# EAGLE schematic VistelV3 (EAGLE 6.4)

## Sheet 1 of 5
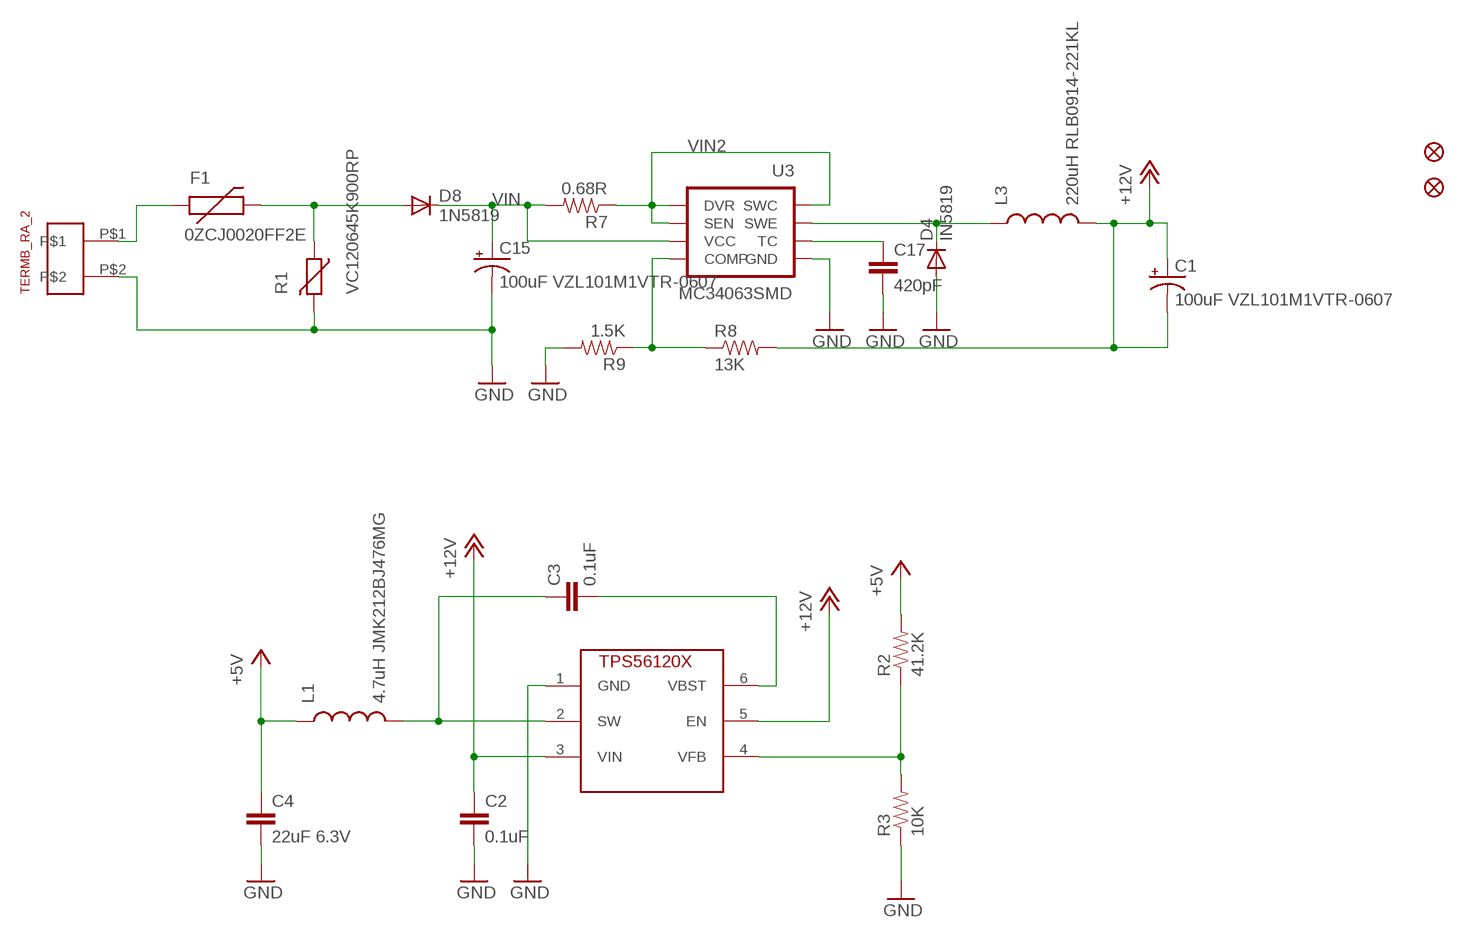
[diagram p0: schematic, sheet 1]

### Parts
C1  100uF VZL101M1VTR-0607  CAP_POLD  [PANASONIC_D]
C2  0.1uF  CAP0805  [0805]
C3  0.1uF  CAP0805  [0805]
C4  22uF 6.3V  CAP0805  [0805]
C15  100uF VZL101M1VTR-0607  CAP_POLD  [PANASONIC_D]
C17  420pF  CAP0805  [0805]
D4  IN5819  DIODESMA  [SMA-DIODE]
D8  1N5819  DIODESMB  [SMB-DIODE]
F1  0ZCJ0020FF2E  PTCSMD  [PTC-1206]
FID1  FIDUCIAL1.5X3  [FIDUCIAL-1.5X3]
FID2  FIDUCIAL1.5X3  [FIDUCIAL-1.5X3]
L1  4.7uH JMK212BJ476MG  INDUCTOR0805  [0805]
L3  220uH RLB0914-221KL  INDUCTORPWR  [CDRH125]
R1  VC120645K900RP  VARISTORCN1206  [CT/CN1206]
R2  41.2K  RESISTOR0805-RES  [0805]
R3  10K  RESISTOR0805-RES  [0805]
R7  0.68R  RESISTOR0805-RES  [0805]
R8  13K  RESISTOR0805-RES  [0805]
R9  1.5K  RESISTOR0805-RES  [0805]
U3  MC34063SMD  [SO08]
U$2  1X02_TERMB_RA  [1X02_TERMB_RA]
U$18  TPS56120X  [TSOT23-6_DDC]

### Nets
+5V: C4.1 L1.1 R2.2
+12V: C1.+ C1.- C2.1 L3.2 R8.2 U$18.3(VIN) U$18.5(EN) ; also sheet 3
GND: C2.2 C4.2 C15.- C17.2 D4.A R1.2 R3.1 R9.2 U3.4(GND) U$2.P$2 U$18.1(GND) ; also sheet 2,3,4,5
N$4: F1.1 U$2.P$1
N$5: D8.A F1.2 R1.1
N$6: C3.1 L1.2 U$18.2(SW)
N$19: C3.2 U$18.6(VBST)
N$20: R2.1 R3.2 U$18.4(VFB)
N$22: C17.1 U3.3(TC)
N$24: D4.C L3.1 U3.2(SWE)
N$25: R8.1 R9.1 U3.5(COMP)
VIN: C15.+ D8.C R7.2 U3.6(VCC)
VIN2: R7.1 U3.1(SWC) U3.7(SEN) U3.8(DVR)

## Sheet 2 of 5
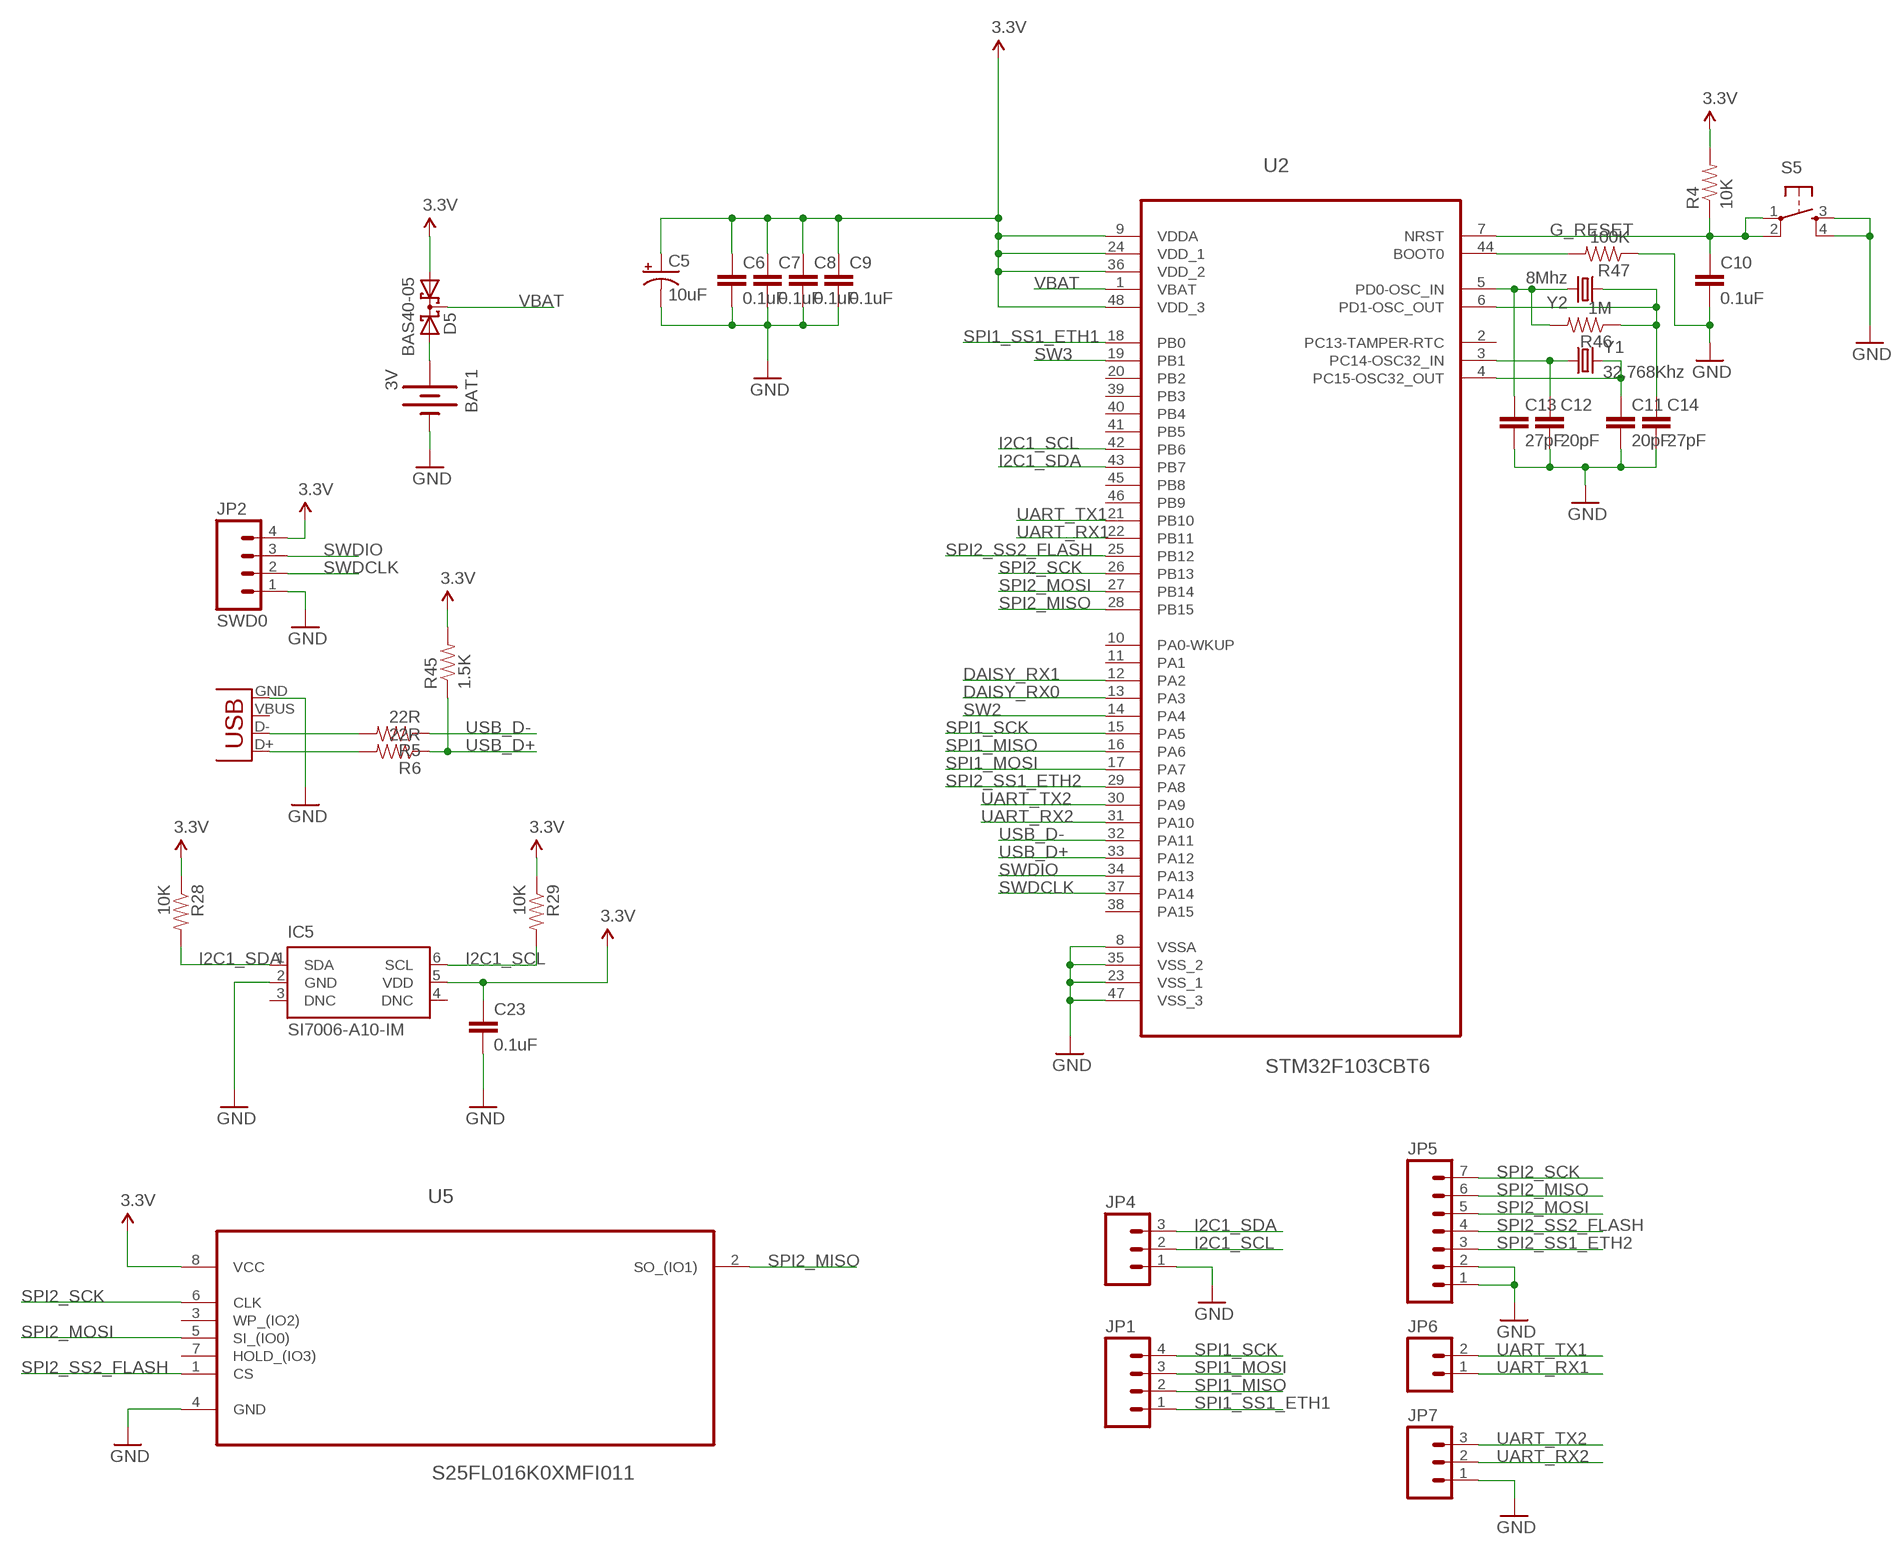
[diagram p1: schematic, sheet 2]

### Parts
BAT1  3V  BATTERY20PTH  [BATTCOM_20MM_PTH]
C5  10uF  10UF-TANT  [EIA3216]
C6  0.1uF  CAP0805  [0805]
C7  0.1uF  CAP0805  [0805]
C8  0.1uF  CAP0805  [0805]
C9  0.1uF  CAP0805  [0805]
C10  0.1uF  CAP0805  [0805]
C11  20pF  CAP0805  [0805]
C12  20pF  CAP0805  [0805]
C13  27pF  CAP0805  [0805]
C14  27pF  CAP0805  [0805]
C23  0.1uF  CAP0805  [0805]
D5  BAS40-05  [SOT23]
IC5  SI7006-A10-IM  [DFN6-3X3]
JP1  M04PTH  [1X04]
JP2  SWD0  M04PTH  [1X04]
JP3  USB-B  USBPTH  [USB-B-PTH]
JP4  M03PTH  [1X03]
JP5  M07  [1X07]
JP6  M02PTH  [1X02]
JP7  M03PTH  [1X03]
R4  10K  RESISTOR0805-RES  [0805]
R5  22R  RESISTOR0805-RES  [0805]
R6  22R  RESISTOR0805-RES  [0805]
R28  10K  RESISTOR0805-RES  [0805]
R29  10K  RESISTOR0805-RES  [0805]
R45  1.5K  RESISTOR0805-RES  [0805]
R46  1M  RESISTOR0805-RES  [0805]
R47  100K  RESISTOR0805-RES  [0805]
S5  TAC_SWITCHPTH  [TACTILE-PTH]
U2  STM32F103CBT6  [QFP50P900X900X160-48N]
U5  S25FL016K0XMFI011  [SOIC127P800X215-8N]
Y1  32.768Khz  MC-306  [MC-306]
Y2  8Mhz  CRYSTALHC49US  [HC49US]

### Nets
3.3V: C5.A(+) C6.1 C7.1 C8.1 C9.1 C23.1 D5.1(A1) IC5.5(VDD) JP2.4 R4.2 R28.1 R29.1 R45.2 U2.9(VDDA) U2.24(VDD_1) U2.36(VDD_2) U2.48(VDD_3) U5.8(VCC) ; also sheet 3,4
BOOT0: R47.2 U2.44(BOOT0)
DAISY_RX0: U2.13(PA3) ; also sheet 3
DAISY_RX1: U2.12(PA2) ; also sheet 3
G_RESET: C10.1 R4.1 S5.1 S5.2 U2.7(NRST) ; also sheet 3
GND: BAT1.2(-) C5.C(-) C6.2 C7.2 C8.2 C9.2 C10.2 C11.2 C12.2 C13.2 C14.2 C23.2 IC5.2(GND) JP2.1 JP3.GND JP4.1 JP5.1 JP5.2 JP7.1 R47.1 S5.3 S5.4 U2.8(VSSA) U2.23(VSS_1) U2.35(VSS_2) U2.47(VSS_3) U5.4(GND) ; also sheet 1,3,4,5
I2C1_SCL: IC5.6(SCL) JP4.2 R29.2 U2.42(PB6)
I2C1_SDA: IC5.1(SDA) JP4.3 R28.2 U2.43(PB7)
N$3: BAT1.1(+) D5.2(A2)
N$7: C14.1 R46.1 U2.6(PD1-OSC_OUT) Y2.1
N$10: JP3.D- R5.2
N$11: JP3.D+ R6.2
N$14: C12.1 U2.3(PC14-OSC32_IN) Y1.1
N$15: C11.1 U2.4(PC15-OSC32_OUT) Y1.4
N$16: C13.1 R46.2 U2.5(PD0-OSC_IN) Y2.2
SPI1_MISO: JP1.2 U2.16(PA6) ; also sheet 4
SPI1_MOSI: JP1.3 U2.17(PA7) ; also sheet 4
SPI1_SCK: JP1.4 U2.15(PA5) ; also sheet 4
SPI1_SS1_ETH1: JP1.1 U2.18(PB0) ; also sheet 4
SPI2_MISO: JP5.6 U2.28(PB15) U5.2(SO_(IO1)) ; also sheet 4
SPI2_MOSI: JP5.5 U2.27(PB14) U5.5(SI_(IO0)) ; also sheet 4
SPI2_SCK: JP5.7 U2.26(PB13) U5.6(CLK) ; also sheet 4
SPI2_SS1_ETH2: JP5.3 U2.29(PA8) ; also sheet 4
SPI2_SS2_FLASH: JP5.4 U2.25(PB12) U5.1(CS)
SW2: U2.14(PA4) ; also sheet 3
SW3: U2.19(PB1) ; also sheet 3
SWDCLK: JP2.2 U2.37(PA14)
SWDIO: JP2.3 U2.34(PA13)
UART_RX1: JP6.1 U2.22(PB11)
UART_RX2: JP7.2 U2.31(PA10) ; also sheet 5
UART_TX1: JP6.2 U2.21(PB10)
UART_TX2: JP7.3 U2.30(PA9) ; also sheet 5
USB_D+: R6.1 R45.1 U2.33(PA12)
USB_D-: R5.1 U2.32(PA11)
VBAT: D5.3(C) U2.1(VBAT)
Unconnected: IC5.3(DNC) IC5.4(DNC) JP3.VBUS U2.2(PC13-TAMPER-RTC) U2.10(PA0-WKUP) U2.11(PA1) U2.20(PB2) U2.38(PA15) U2.39(PB3) U2.40(PB4) U2.41(PB5) U2.45(PB8) U2.46(PB9) U5.3(WP_(IO2)) U5.7(HOLD_(IO3))

## Sheet 3 of 5
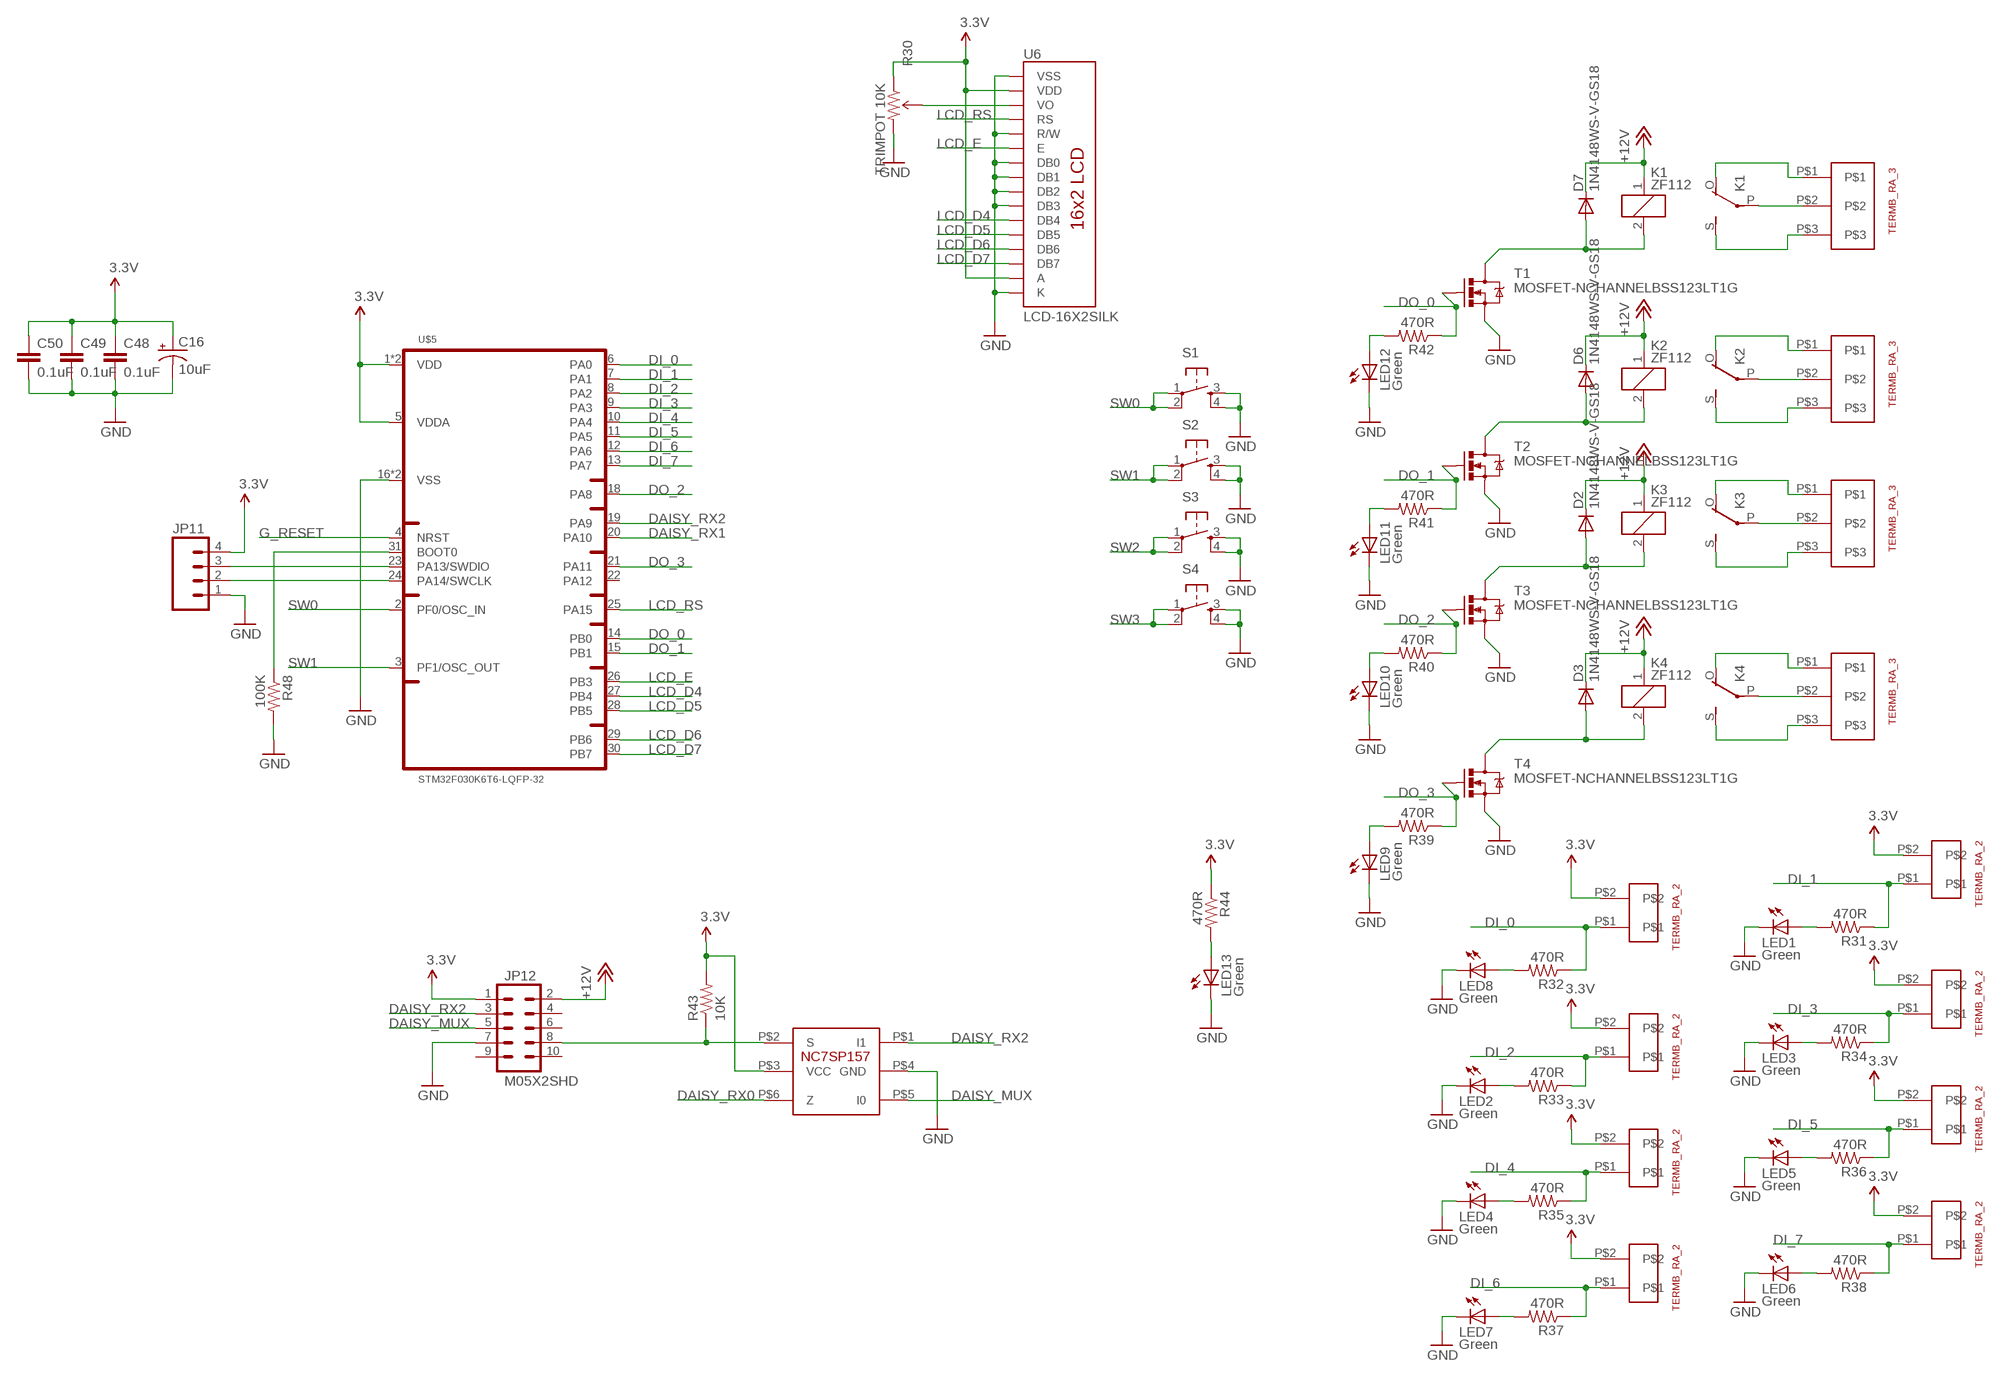
[diagram p2: schematic, sheet 3]

### Parts
C16  10uF  10UF-TANT  [EIA3216]
C48  0.1uF  CAP0805  [0805]
C49  0.1uF  CAP0805  [0805]
C50  0.1uF  CAP0805  [0805]
D2  1N4148WS-V-GS18  DIODESMA-ALT  [SMA-DIODE_ALT]
D3  1N4148WS-V-GS18  DIODESMA-ALT  [SMA-DIODE_ALT]
D6  1N4148WS-V-GS18  DIODESMA-ALT  [SMA-DIODE_ALT]
D7  1N4148WS-V-GS18  DIODESMA-ALT  [SMA-DIODE_ALT]
JP11  M04PTH  [1X04]
JP12  M05X2SHD  [2X5-SHROUDED]
K1  ZF112  [ZF112]
K2  ZF112  [ZF112]
K3  ZF112  [ZF112]
K4  ZF112  [ZF112]
LED1  Green  LED1206  [LED-1206]
LED2  Green  LED1206  [LED-1206]
LED3  Green  LED1206  [LED-1206]
LED4  Green  LED1206  [LED-1206]
LED5  Green  LED1206  [LED-1206]
LED6  Green  LED1206  [LED-1206]
LED7  Green  LED1206  [LED-1206]
LED8  Green  LED1206  [LED-1206]
LED9  Green  LED1206  [LED-1206]
LED10  Green  LED1206  [LED-1206]
LED11  Green  LED1206  [LED-1206]
LED12  Green  LED1206  [LED-1206]
LED13  Green  LED1206  [LED-1206]
R30  TRIMPOT 10K  TRIMPOTPTH  [TRIM_POT_PTH]
R31  470R  RESISTOR0805-RES  [0805]
R32  470R  RESISTOR0805-RES  [0805]
R33  470R  RESISTOR0805-RES  [0805]
R34  470R  RESISTOR0805-RES  [0805]
R35  470R  RESISTOR0805-RES  [0805]
R36  470R  RESISTOR0805-RES  [0805]
R37  470R  RESISTOR0805-RES  [0805]
R38  470R  RESISTOR0805-RES  [0805]
R39  470R  RESISTOR0805-RES  [0805]
R40  470R  RESISTOR0805-RES  [0805]
R41  470R  RESISTOR0805-RES  [0805]
R42  470R  RESISTOR0805-RES  [0805]
R43  10K  RESISTOR0805-RES  [0805]
R44  470R  RESISTOR0805-RES  [0805]
R48  100K  RESISTOR0805-RES  [0805]
S1  TAC_SWITCHPTH  [TACTILE-PTH]
S2  TAC_SWITCHPTH  [TACTILE-PTH]
S3  TAC_SWITCHPTH  [TACTILE-PTH]
S4  TAC_SWITCHPTH  [TACTILE-PTH]
T1  MOSFET-NCHANNELBSS123LT1G  [SOT23]
T2  MOSFET-NCHANNELBSS123LT1G  [SOT23]
T3  MOSFET-NCHANNELBSS123LT1G  [SOT23]
T4  MOSFET-NCHANNELBSS123LT1G  [SOT23]
U6  LCD-16X2SILK  [LCD-16X2]
U$4  NC7SP157  [SC70-6]
U$5  STM32F030K6T6-LQFP-32  [LQFP-32]
U$6  1X02_TERMB_RA  [1X02_TERMB_RA]
U$7  1X02_TERMB_RA  [1X02_TERMB_RA]
U$8  1X02_TERMB_RA  [1X02_TERMB_RA]
U$9  1X02_TERMB_RA  [1X02_TERMB_RA]
U$10  1X02_TERMB_RA  [1X02_TERMB_RA]
U$11  1X02_TERMB_RA  [1X02_TERMB_RA]
U$12  1X02_TERMB_RA  [1X02_TERMB_RA]
U$13  1X02_TERMB_RA  [1X02_TERMB_RA]
U$14  1X03_TERMB_RA  [1X03_TERMB_RA]
U$15  1X03_TERMB_RA  [1X03_TERMB_RA]
U$16  1X03_TERMB_RA  [1X03_TERMB_RA]
U$17  1X03_TERMB_RA  [1X03_TERMB_RA]

### Nets
3.3V: C16.A(+) C48.1 C49.1 C50.1 JP11.4 JP12.1 R30.1(CCW) R43.2 R44.1 U6.2(VDD) U6.15(A) U$4.P$3(VCC) U$5.1(VDD) U$5.5(VDDA) U$5.17(VDD) U$6.P$2 U$7.P$2 U$8.P$2 U$9.P$2 U$10.P$2 U$11.P$2 U$12.P$2 U$13.P$2 ; also sheet 2,4
+12V: D2.C D3.C D6.C D7.C JP12.2 K1.1 K2.1 K3.1 K4.1 ; also sheet 1
DAISY_MUX: JP12.5 U$4.P$5(I0)
DAISY_RX0: U$4.P$6(Z) ; also sheet 2
DAISY_RX1: U$5.20(PA10) ; also sheet 2
DAISY_RX2: JP12.3 U$4.P$1(I1) U$5.19(PA9)
DI_0: R32.1 U$5.6(PA0) U$6.P$1
DI_1: R31.1 U$5.7(PA1) U$7.P$1
DI_2: R33.1 U$5.8(PA2) U$13.P$1
DI_3: R34.1 U$5.9(PA3) U$8.P$1
DI_4: R35.1 U$5.10(PA4) U$12.P$1
DI_5: R36.1 U$5.11(PA5) U$9.P$1
DI_6: R37.1 U$5.12(PA6) U$11.P$1
DI_7: R38.1 U$5.13(PA7) U$10.P$1
DO_0: R42.1 T1.1(G) U$5.14(PB0)
DO_1: R41.1 T2.1(G) U$5.15(PB1)
DO_2: R40.1 T3.1(G) U$5.18(PA8)
DO_3: R39.1 T4.1(G) U$5.21(PA11)
G_RESET: U$5.4(NRST) ; also sheet 2
GND: C16.C(-) C48.2 C49.2 C50.2 JP11.1 JP12.7 LED1.C LED2.C LED3.C LED4.C LED5.C LED6.C LED7.C LED8.C LED9.C LED10.C LED11.C LED12.C LED13.C R30.3(CW) R48.2 S1.3 S1.4 S2.3 S2.4 S3.3 S3.4 S4.3 S4.4 T1.2(S) T2.2(S) T3.2(S) T4.2(S) U6.1(VSS) U6.5(R/W) U6.7(DB0) U6.8(DB1) U6.9(DB2) U6.10(DB3) U6.16(K) U$4.P$4(GND) U$5.16(VSS) U$5.32(VSS) ; also sheet 1,2,4,5
LCD_D4: U6.11(DB4) U$5.27(PB4)
LCD_D5: U6.12(DB5) U$5.28(PB5)
LCD_D6: U6.13(DB6) U$5.29(PB6)
LCD_D7: U6.14(DB7) U$5.30(PB7)
LCD_E: U6.6(E) U$5.26(PB3)
LCD_RS: U6.4(RS) U$5.25(PA15)
N$1: K1.P(2:P) U$14.P$2
N$8: LED13.A R44.2
N$9: LED7.A R37.2
N$12: R30.2(WIPER) U6.3(VO)
N$13: K4.O(2:O) U$17.P$1
N$17: R48.1 U$5.31(BOOT0)
N$21: K4.S(2:S) U$17.P$3
N$53: K3.S(2:S) U$16.P$3
N$54: K2.P(2:P) U$15.P$2
N$55: K3.O(2:O) U$16.P$1
N$56: K2.O(2:O) U$15.P$1
N$57: K2.S(2:S) U$15.P$3
N$58: K3.P(2:P) U$16.P$2
N$59: K1.O(2:O) U$14.P$1
N$60: K4.P(2:P) U$17.P$2
N$61: K1.S(2:S) U$14.P$3
N$62: D7.A K1.2 T1.3(D)
N$63: D6.A K2.2 T2.3(D)
N$64: D2.A K3.2 T3.3(D)
N$65: D3.A K4.2 T4.3(D)
N$66: LED12.A R42.2
N$67: LED11.A R41.2
N$69: JP11.3 U$5.23(PA13/SWDIO)
N$70: LED10.A R40.2
N$71: JP11.2 U$5.24(PA14/SWCLK)
N$72: LED9.A R39.2
N$73: LED1.A R31.2
N$74: LED8.A R32.2
N$75: LED2.A R33.2
N$77: JP12.8 R43.1 U$4.P$2(S)
N$78: LED3.A R34.2
N$80: LED5.A R36.2
N$82: LED4.A R35.2
N$87: LED6.A R38.2
SW0: S1.1 S1.2 U$5.2(PF0/OSC_IN)
SW1: S2.1 S2.2 U$5.3(PF1/OSC_OUT)
SW2: S3.1 S3.2 ; also sheet 2
SW3: S4.1 S4.2 ; also sheet 2
Unconnected: JP12.4 JP12.6 JP12.9 JP12.10 U$5.22(PA12)

## Sheet 4 of 5
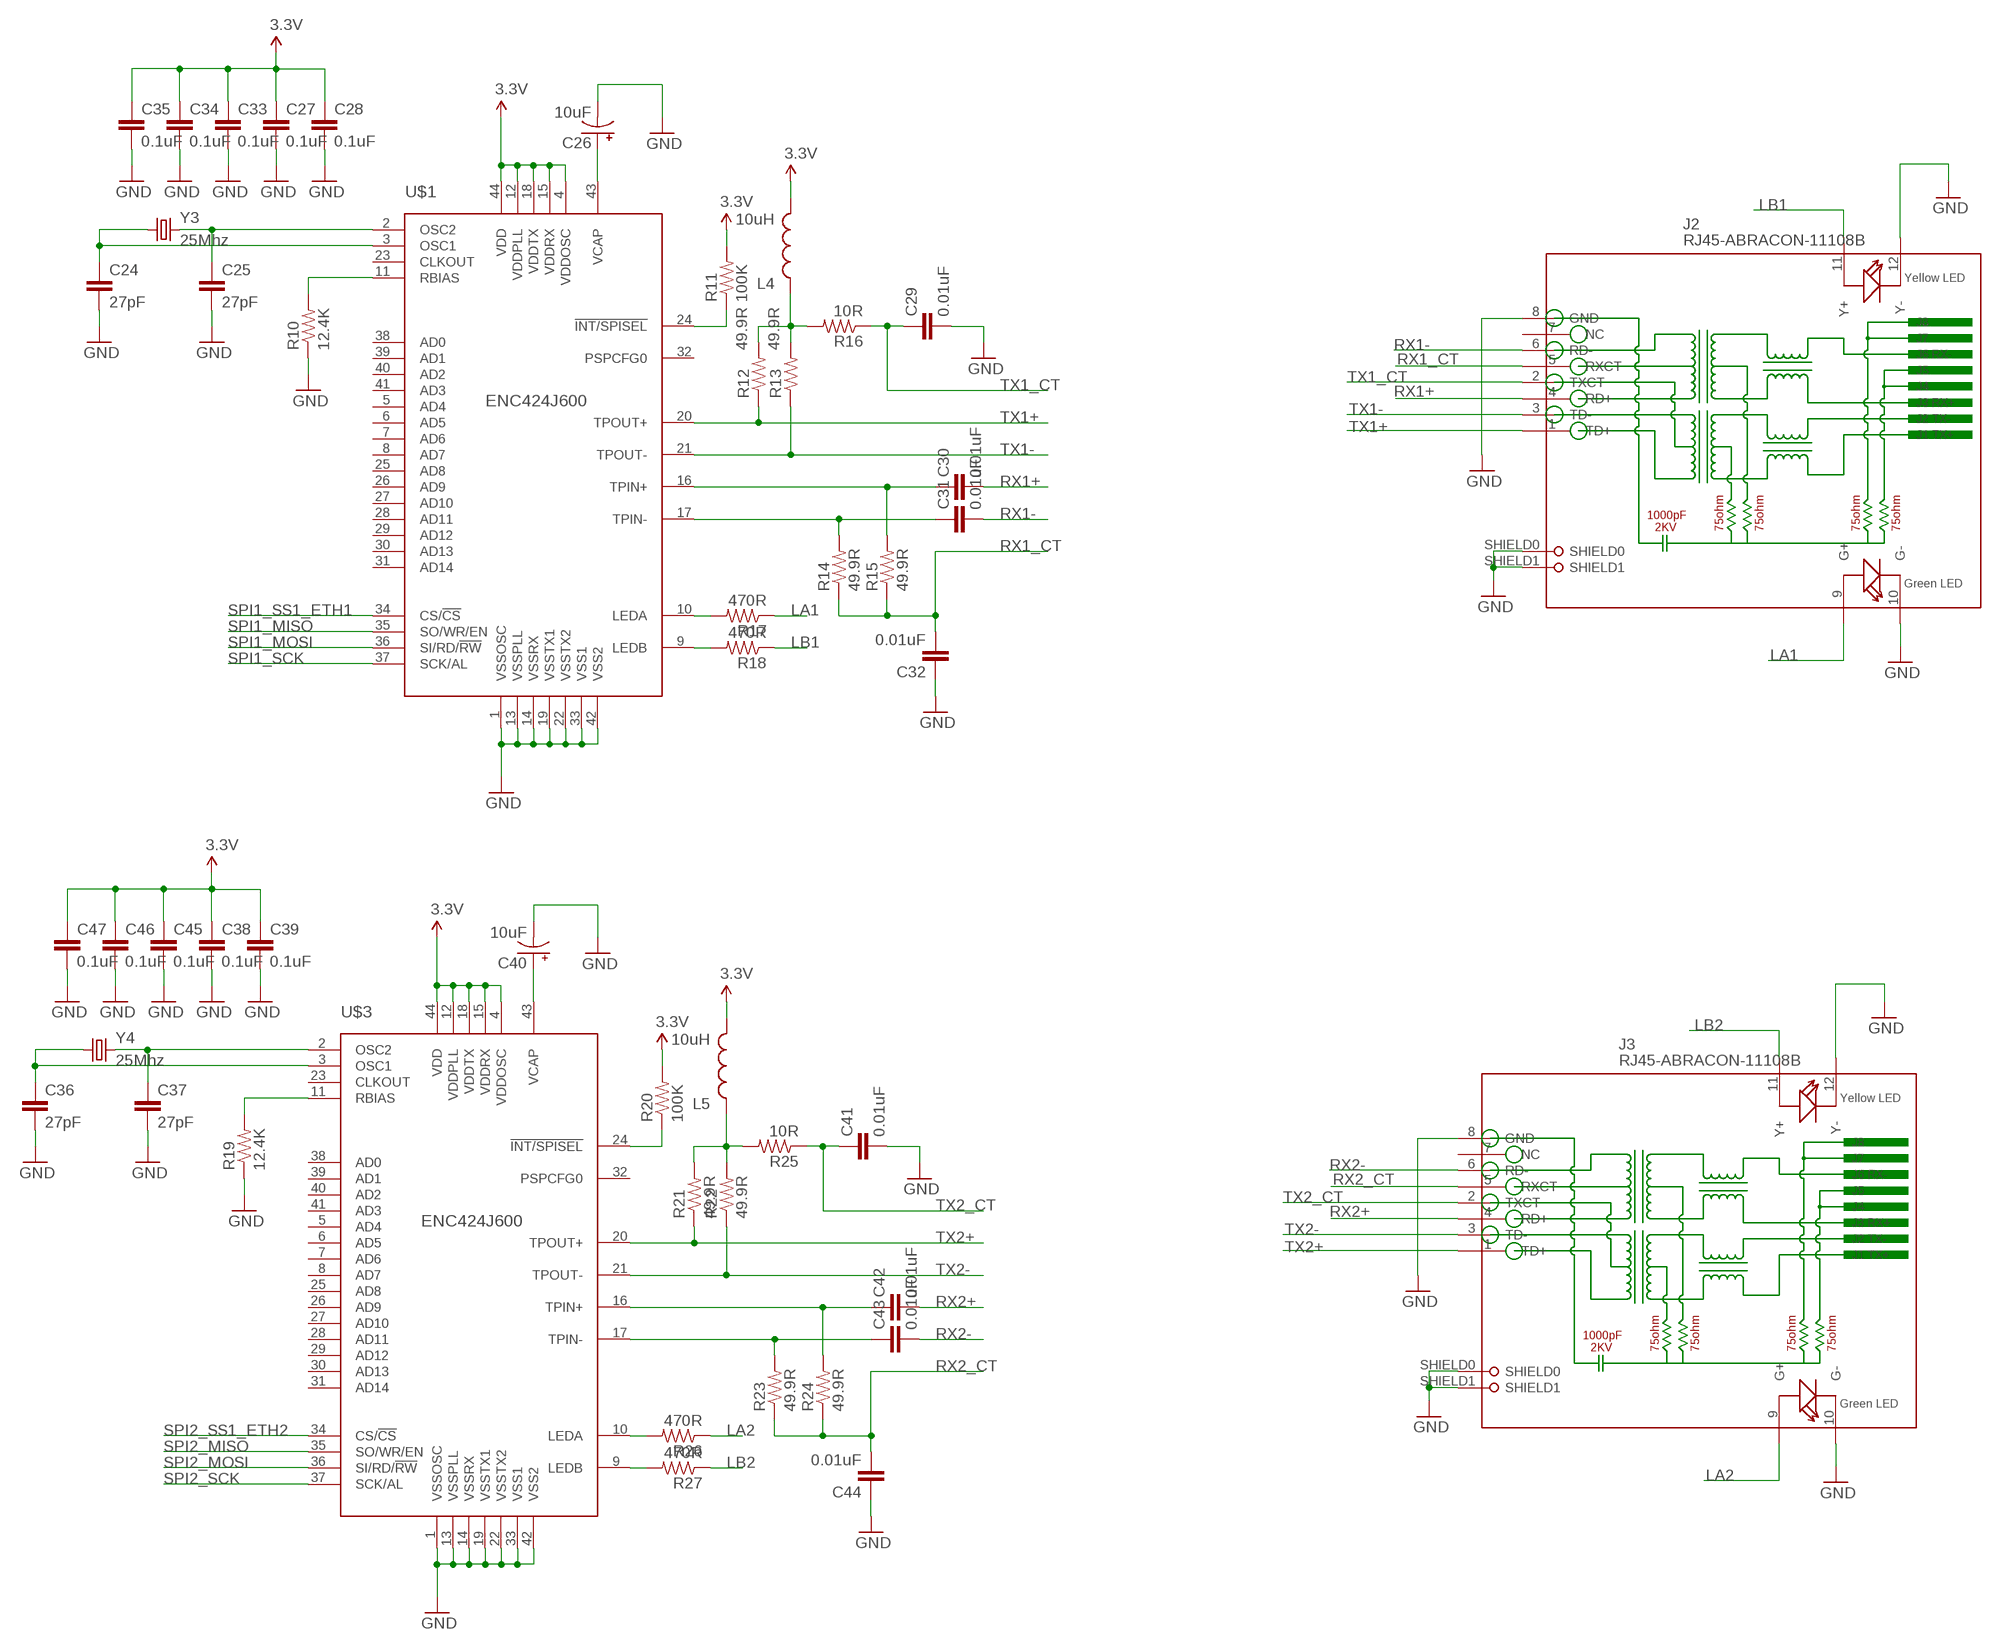
[diagram p3: schematic, sheet 4]

### Parts
C24  27pF  CAP0805  [0805]
C25  27pF  CAP0805  [0805]
C26  10uF  CAP_POL3528-KIT  [EIA3528-KIT]
C27  0.1uF  CAP0805  [0805]
C28  0.1uF  CAP0805  [0805]
C29  0.01uF  CAP0805  [0805]
C30  0.01uF  CAP0805  [0805]
C31  0.01uF  CAP0805  [0805]
C32  0.01uF  CAP0805  [0805]
C33  0.1uF  CAP0805  [0805]
C34  0.1uF  CAP0805  [0805]
C35  0.1uF  CAP0805  [0805]
C36  27pF  CAP0805  [0805]
C37  27pF  CAP0805  [0805]
C38  0.1uF  CAP0805  [0805]
C39  0.1uF  CAP0805  [0805]
C40  10uF  CAP_POL3528-KIT  [EIA3528-KIT]
C41  0.01uF  CAP0805  [0805]
C42  0.01uF  CAP0805  [0805]
C43  0.01uF  CAP0805  [0805]
C44  0.01uF  CAP0805  [0805]
C45  0.1uF  CAP0805  [0805]
C46  0.1uF  CAP0805  [0805]
C47  0.1uF  CAP0805  [0805]
J2  RJ45-ABRACON-11108B  [RJ45-ABRACON-111008B]
J3  RJ45-ABRACON-11108B  [RJ45-ABRACON-111008B]
L4  10uH  INDUCTOR0805  [0805]
L5  10uH  INDUCTOR0805  [0805]
R10  12.4K  RESISTOR0805-RES  [0805]
R11  100K  RESISTOR0805-RES  [0805]
R12  49.9R  RESISTOR0805-RES  [0805]
R13  49.9R  RESISTOR0805-RES  [0805]
R14  49.9R  RESISTOR0805-RES  [0805]
R15  49.9R  RESISTOR0805-RES  [0805]
R16  10R  RESISTOR0805-RES  [0805]
R17  470R  RESISTOR0805-RES  [0805]
R18  470R  RESISTOR0805-RES  [0805]
R19  12.4K  RESISTOR0805-RES  [0805]
R20  100K  RESISTOR0805-RES  [0805]
R21  49.9R  RESISTOR0805-RES  [0805]
R22  49.9R  RESISTOR0805-RES  [0805]
R23  49.9R  RESISTOR0805-RES  [0805]
R24  49.9R  RESISTOR0805-RES  [0805]
R25  10R  RESISTOR0805-RES  [0805]
R26  470R  RESISTOR0805-RES  [0805]
R27  470R  RESISTOR0805-RES  [0805]
U$1  ENC424J600  [TQFP-44]
U$3  ENC424J600  [TQFP-44]
Y3  25Mhz  CRYSTAL10.5X4.8  [CRYSTAL-SMD-10.5X4.8-2PIN]
Y4  25Mhz  CRYSTAL10.5X4.8  [CRYSTAL-SMD-10.5X4.8-2PIN]

### Nets
3.3V: C27.1 C28.1 C33.1 C34.1 C35.1 C38.1 C39.1 C45.1 C46.1 C47.1 L4.2 L5.2 R11.2 R20.2 U$1.4(VDDOSC) U$1.12(VDDPLL) U$1.15(VDDRX) U$1.18(VDDTX) U$1.44(VDD) U$3.4(VDDOSC) U$3.12(VDDPLL) U$3.15(VDDRX) U$3.18(VDDTX) U$3.44(VDD) ; also sheet 2,3
GND: C24.2 C25.2 C26.C(-) C27.2 C28.2 C29.2 C32.1 C33.2 C34.2 C35.2 C36.2 C37.2 C38.2 C39.2 C40.C(-) C41.2 C44.1 C45.2 C46.2 C47.2 J2.8(GND) J2.10(G-) J2.12(Y-) J2.SHIELD0 J2.SHIELD1 J3.8(GND) J3.10(G-) J3.12(Y-) J3.SHIELD0 J3.SHIELD1 R10.1 R19.1 U$1.1(VSSOSC) U$1.13(VSSPLL) U$1.14(VSSRX) U$1.19(VSSTX1) U$1.22(VSSTX2) U$1.33(VSS1) U$1.42(VSS2) U$3.1(VSSOSC) U$3.13(VSSPLL) U$3.14(VSSRX) U$3.19(VSSTX1) U$3.22(VSSTX2) U$3.33(VSS1) U$3.42(VSS2) ; also sheet 1,2,3,5
LA1: J2.9(G+) R17.1
LA2: J3.9(G+) R26.1
LB1: J2.11(Y+) R18.1
LB2: J3.11(Y+) R27.1
N$33: C24.1 U$1.3(OSC1) Y3.P$1
N$34: C40.A(+) U$3.43(VCAP)
N$35: C37.1 U$3.2(OSC2) Y4.P$2
N$36: C30.1 R15.2 U$1.16(TPIN+)
N$37: C26.A(+) U$1.43(VCAP)
N$38: C31.1 R14.2 U$1.17(TPIN-)
N$39: R19.2 U$3.11(RBIAS)
N$40: C25.1 U$1.2(OSC2) Y3.P$2
N$41: R10.2 U$1.11(RBIAS)
N$42: R11.1 U$1.24(!INT/SPISEL)
N$43: R17.2 U$1.10(LEDA)
N$44: R18.2 U$1.9(LEDB)
N$45: L4.1 R12.2 R13.2 R16.2
N$46: R20.1 U$3.24(!INT/SPISEL)
N$47: C36.1 U$3.3(OSC1) Y4.P$1
N$48: C42.1 R24.2 U$3.16(TPIN+)
N$49: C43.1 R23.2 U$3.17(TPIN-)
N$50: L5.1 R21.2 R22.2 R25.2
N$51: R26.2 U$3.10(LEDA)
N$52: R27.2 U$3.9(LEDB)
RX1+: C30.2 J2.4(RD+)
RX1-: C31.2 J2.6(RD-)
RX1_CT: C32.2 J2.5(RXCT) R14.1 R15.1
RX2+: C42.2 J3.4(RD+)
RX2-: C43.2 J3.6(RD-)
RX2_CT: C44.2 J3.5(RXCT) R23.1 R24.1
SPI1_MISO: U$1.35(SO/WR/EN) ; also sheet 2
SPI1_MOSI: U$1.36(SI/RD/!RW) ; also sheet 2
SPI1_SCK: U$1.37(SCK/AL) ; also sheet 2
SPI1_SS1_ETH1: U$1.34(CS/!CS) ; also sheet 2
SPI2_MISO: U$3.35(SO/WR/EN) ; also sheet 2
SPI2_MOSI: U$3.36(SI/RD/!RW) ; also sheet 2
SPI2_SCK: U$3.37(SCK/AL) ; also sheet 2
SPI2_SS1_ETH2: U$3.34(CS/!CS) ; also sheet 2
TX1+: J2.1(TD+) R12.1 U$1.20(TPOUT+)
TX1-: J2.3(TD-) R13.1 U$1.21(TPOUT-)
TX1_CT: C29.1 J2.2(TXCT) R16.1
TX2+: J3.1(TD+) R21.1 U$3.20(TPOUT+)
TX2-: J3.3(TD-) R22.1 U$3.21(TPOUT-)
TX2_CT: C41.1 J3.2(TXCT) R25.1
Unconnected: J2.7(NC) J3.7(NC) U$1.5(AD4) U$1.6(AD5) U$1.7(AD6) U$1.8(AD7) U$1.23(CLKOUT) U$1.25(AD8) U$1.26(AD9) U$1.27(AD10) U$1.28(AD11) U$1.29(AD12) U$1.30(AD13) U$1.31(AD14) U$1.32(PSPCFG0) U$1.38(AD0) U$1.39(AD1) U$1.40(AD2) U$1.41(AD3) U$3.5(AD4) U$3.6(AD5) U$3.7(AD6) U$3.8(AD7) U$3.23(CLKOUT) U$3.25(AD8) U$3.26(AD9) U$3.27(AD10) U$3.28(AD11) U$3.29(AD12) U$3.30(AD13) U$3.31(AD14) U$3.32(PSPCFG0) U$3.38(AD0) U$3.39(AD1) U$3.40(AD2) U$3.41(AD3)

## Sheet 5 of 5
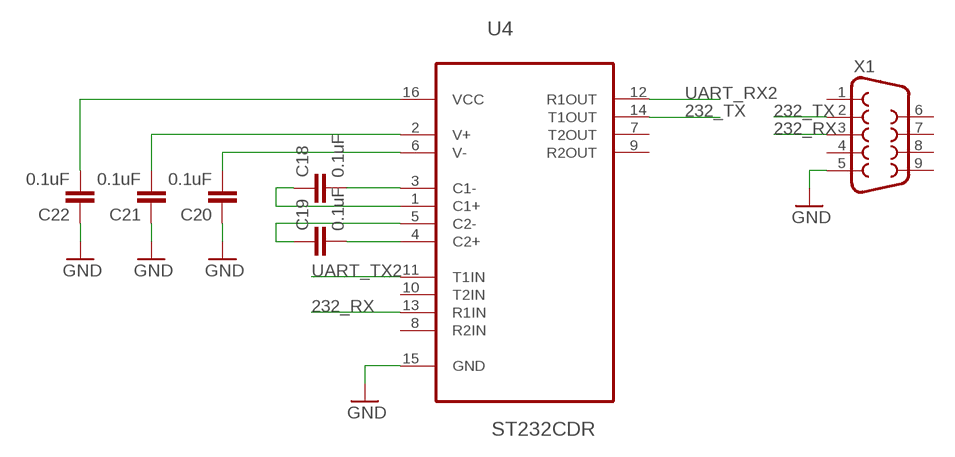
[diagram p4: schematic, sheet 5]

### Parts
C18  0.1uF  CAP0805  [0805]
C19  0.1uF  CAP0805  [0805]
C20  0.1uF  CAP0805  [0805]
C21  0.1uF  CAP0805  [0805]
C22  0.1uF  CAP0805  [0805]
U4  ST232CDR  [SOIC127P600X175-16N]
X1  DB9FEMALE  [DB9]

### Nets
232_RX: U4.13(R1IN) X1.3
232_TX: U4.14(T1OUT) X1.2
GND: C20.1 C21.1 C22.1 U4.15(GND) X1.5 ; also sheet 1,2,3,4
N$2: C22.2 U4.16(VCC)
N$26: C21.2 U4.2(V+)
N$27: C20.2 U4.6(V-)
N$28: C18.2 U4.3(C1-)
N$29: C18.1 U4.1(C1+)
N$30: C19.1 U4.5(C2-)
N$31: C19.2 U4.4(C2+)
UART_RX2: U4.12(R1OUT) ; also sheet 2
UART_TX2: U4.11(T1IN) ; also sheet 2
Unconnected: U4.7(T2OUT) U4.8(R2IN) U4.9(R2OUT) U4.10(T2IN) X1.1 X1.4 X1.6 X1.7 X1.8 X1.9

## Library data of the parts
BAT1 = SparkFun-Electromechanical:BATTERY: Battery Holders Various common sizes : AA, AAA, 20mm coin cell and 12mm coin cell. 20MM_4LEGS, BATT-10373
C1 C15 C26 C40 = SparkFun-Capacitors:CAP_POL: Capacitor Polarized These are standard SMD and PTH capacitors. Normally 10uF, 47uF, and 100uF in electrolytic and tantalum varieties. Always verify the external diameter of the through hole cap, it varies with capacity, voltage, and manufacturer. The EIA devices should be standard.
C2-C4 C17-C22 = SparkFun-Passives:CAP: Capacitor Standard 0603 ceramic capacitor, and 0.1" leaded capacitor.
C5 C16 = SparkFun-Capacitors:10UF-TANT: 10uF Tantalum SMT CAP-00811- 16V 10% (EIA-3216); PROD_ID: CAP-00811
C6-C14 C23-C25 C27-C39 C41-C50 = SparkFun-Capacitors:CAP: Capacitor Standard 0603 ceramic capacitor, and 0.1" leaded capacitor.
D2-D4 D6-D8 = SparkFun-DiscreteSemi:DIODE: Diode These are standard reverse protection diodes and small signal diodes. SMA package can handle up to about 1A. SOD-323 can handle about 200mA. What the SOD-323 package when ordering, there are some mfgs out there that are 5-pin packages.
D5 = diode:BAS40-05: Silicon Schottky Diodes General-purpose diode for high-speed switching
F1 = SparkFun-PowerIC:PTC: Resettable Fuse PTC Resettable Fuse. Spark Fun Electronics SKU : COM-08357
FID1 FID2 = SparkFun-Aesthetics:FIDUCIAL: Fiducial Alignment Points Various fiducial points for machine vision alignment.
IC5 = si70xx-10:SI7006-*: I2C Humidity and Temperature Sensor Source: http://www.silabs.com/Support%20Documents/TechnicalDocs/Si7006-A10.pdf; MF: Silicon Labs; MPN: Si7006-A10-IM; OC_FARNELL: unknown; OC_NEWARK: unknown
J2 J3 = Connector:RJ45-ABRACON-11108B
JP1 JP2 JP11 = SparkFun-Connectors:M04: Header 4 Standard 4-pin 0.1" header. Use with straight break away headers (SKU : PRT-00116), right angle break away headers (PRT-00553), swiss pins (PRT-00743), machine pins (PRT-00117), and female headers (PRT-00115). Molex polarized connector foot print use with SKU : PRT-08231 with associated crimp pins and housings. 1MM SMD Version SKU: PRT-10208
JP3 = SparkFun-Connectors:USB: USB Connectors USB-B-PTH is fully proven SKU : PRT-00139/CONN-08278 USB-miniB is fully proven SKU : PRT-00587 USB-A-PCB is untested. USB-A-H is throughly reviewed, but untested. Spark Fun Electronics SKU : PRT-00437 USB-B-SMT is throughly reviewed, but untested. Needs silkscreen touching up. USB-A-S has not been used/tested USB-MB-H has not been used/tested USB-MICROB has been used. CONN-09505; PROD_ID: CONN-08278
JP4 JP7 = SparkFun-Connectors:M03: Header 3 Standard 3-pin 0.1" header. Use with straight break away headers (SKU : PRT-00116), right angle break away headers (PRT-00553), swiss pins (PRT-00743), machine pins (PRT-00117), and female headers (PRT-00115). Molex polarized connector foot print use with SKU : PRT-08232 with associated crimp pins and housings.
JP5 = SparkFun-Connectors:M07: Header 7 Standard 7-pin 0.1" header. Use with straight break away headers (SKU : PRT-00116), right angle break away headers (PRT-00553), swiss pins (PRT-00743), machine pins (PRT-00117), and female headers (PRT-00115). NOTES ON THE VARIANTS LOCK and LOCK_LONGPADS... This footprint was designed to help hold the alignment of a through-hole component (i.e. 7-pin header) while soldering it into place. You may notice that each hole has been shifted either up or down by 0.005 of an inch from it's more standard position (which is usually a perfectly straight line). This slight alteration caused the pins (the squares in the middle) to touch the edges of the holes. Because they are alternating, it causes a "brace" to hold the header in place. 0.005 has proven to be the perfect amount of "off-center" position when using our standard breakaway headers. Although looks a little odd when you look at the bare footprint, once you have a header in there, the alteration is very hard to notice. Also, if you push a header all the way into place, it is covered up entirely on the bottom side. This idea of altering the position of holes to aid alignment will be further integrated into the Sparkfun Library for other footprints. It can help hold any component with 3 or more connection pins.
JP6 = SparkFun-Connectors:M02: Header 2 Standard 2-pin 0.1" header. Use with straight break away headers (SKU : PRT-00116), right angle break away headers (PRT-00553), swiss pins (PRT-00743), machine pins (PRT-00117), and female headers (PRT-00115). Molex polarized connector foot print use with SKU : PRT-08233 with associated crimp pins and housings.
JP12 = SparkFun-Connectors:M05X2: Header 5x2 Standard 10-pin dual row 0.1" header. Commonly used with AVR-ISP. Use with Spark Fun Electronics SKU: PRT-00778
K1-K4 = relay:ZF112: RELAY 1 x switch; OC_FARNELL: unknown; OC_NEWARK: unknown
L1 L3-L5 = SparkFun-Passives:INDUCTOR: Inductors Basic Inductor/Choke - 0603 and 1206. Footprints are not proven and vary greatly between part numbers.
LED1-LED13 = SparkFun-LED:LED: LEDs Standard schematic elements and footprints for 5mm, 3mm, 1206, and 0603 sized LEDs. 5mm - Spark Fun Electronics SKU : COM-00529 (and others)
R1 = varistor:VARISTOR: VARISTOR
R2 R3 R7-R9 R31-R44 R48 = SparkFun-Passives:RESISTOR: Resistor Basic schematic elements and footprints for 0603, 1206, and PTH resistors.
R4-R6 R10-R29 R45-R47 = SparkFun-Resistors:RESISTOR: Resistor Basic schematic elements and footprints for 0603, 1206, and PTH resistors.
R30 = SparkFun-Electromechanical:TRIMPOT: Various small potentiometers for "set-and-forget" applications
S1-S5 = SparkFun-Electromechanical:TAC_SWITCH: Momentary Switch Button commonly used for reset or general input. Spark Fun Electronics SKU : COM-00097 SMT- SWCH-08247
T1-T4 = SparkFun-DiscreteSemi:MOSFET-NCHANNEL: Common NMOSFET Parts MFG P/N Store ID Prod ID FDD8780 TRANS-09984 SI7820DN TRANS-11055 FDS6630A IC-08089 2N7002PW TRANS-11151 FQP30N06L COM-10213 TRANS-10060 BSS123LT1G TRANS-08345 BSS138 TRANS-00830 BS170 2N7000; PROD_ID: TRANS-08345
U2 = ST Microelctronics_By_element14_Batch_1:STM32F103CBT6: Medium-density performance line ARM-based 32-bit MCU; MPN: STM32F103CBT6; OC_FARNELL: 1606327; OC_NEWARK: 11N8296; PACKAGE: QFP-48; SUPPLIER: STMICROELECTRONICS
U3 = SparkFun-PowerIC:MC34063: Jellybean switching supply controller
U4 = ST Microelctronics_By_element14_Batch_1:ST232CDR: 5 V powered multi-channel RS-232 drivers and receivers; MPN: ST232CDR; OC_FARNELL: 1564303; OC_NEWARK: 89K0993; PACKAGE: SOIC-16; SUPPLIER: STMICROELECTRONICS
U5 = Spansion_By_element14_Batch_1:S25FL016K0XMFI011: 16-Mbit CMOS 3.0 Volt Flash Memory; MPN: S25FL016K0XMFI011; OC_FARNELL: 1861628; OC_NEWARK: 27T2971; PACKAGE: SOIC-8; SUPPLIER: SPANSION
U6 = SparkFun-Displays:LCD-16X2: Standard text-only 16x2 parallel input LCD
U$1 U$3 = microchip-encx24j600:ENC424J600: MICROCHIP ENC424J600 Stand-Alone 10/100 Ethernet Controller with SPI or Parallel Interface
U$2 U$6-U$13 = SparkFun-Connectors:1X02_TERMB_RA
U$4 = nxp_60:NC7SP157
U$5 = STM32F030K6T6:STM32F030K6T6
U$14-U$17 = SparkFun-Connectors:1X03_TERMB_RA
U$18 = VistelV3:TPS56120X
X1 = SparkFun-Connectors:DB9: DB9 Connector Standard DB9 (D-Sub 9) serial connector. Can be used for CAN bus as well as RS485 and RS232. Footprint production proven. Spark Fun Electronics SKU : PRT-00429
Y1 = crystal:MC-306: kHz RANGE CRYSTAL UNIT SMD Source: MC-306_405_406_E07X.PDF Homepage <http://www.epsontoyocom.co.jp>; MPN: MC-306 60.0KHZ 100PPM ,12.5PF; OC_FARNELL: 1278040; OC_NEWARK: 31M5576
Y2-Y4 = SparkFun-FreqCtrl:CRYSTAL: Various standard crystals. Proven footprints. Spark Fun Electronics SKU : COM-00534